# EasyEDA schematic SCH_IoTNode_2025-08-17.json
TITLE: Sheet_1; REV: 1.0; Date: 2025-08-13; Sheet: 1/1; Drawn By: digtaalfathir36; Company: BayMax
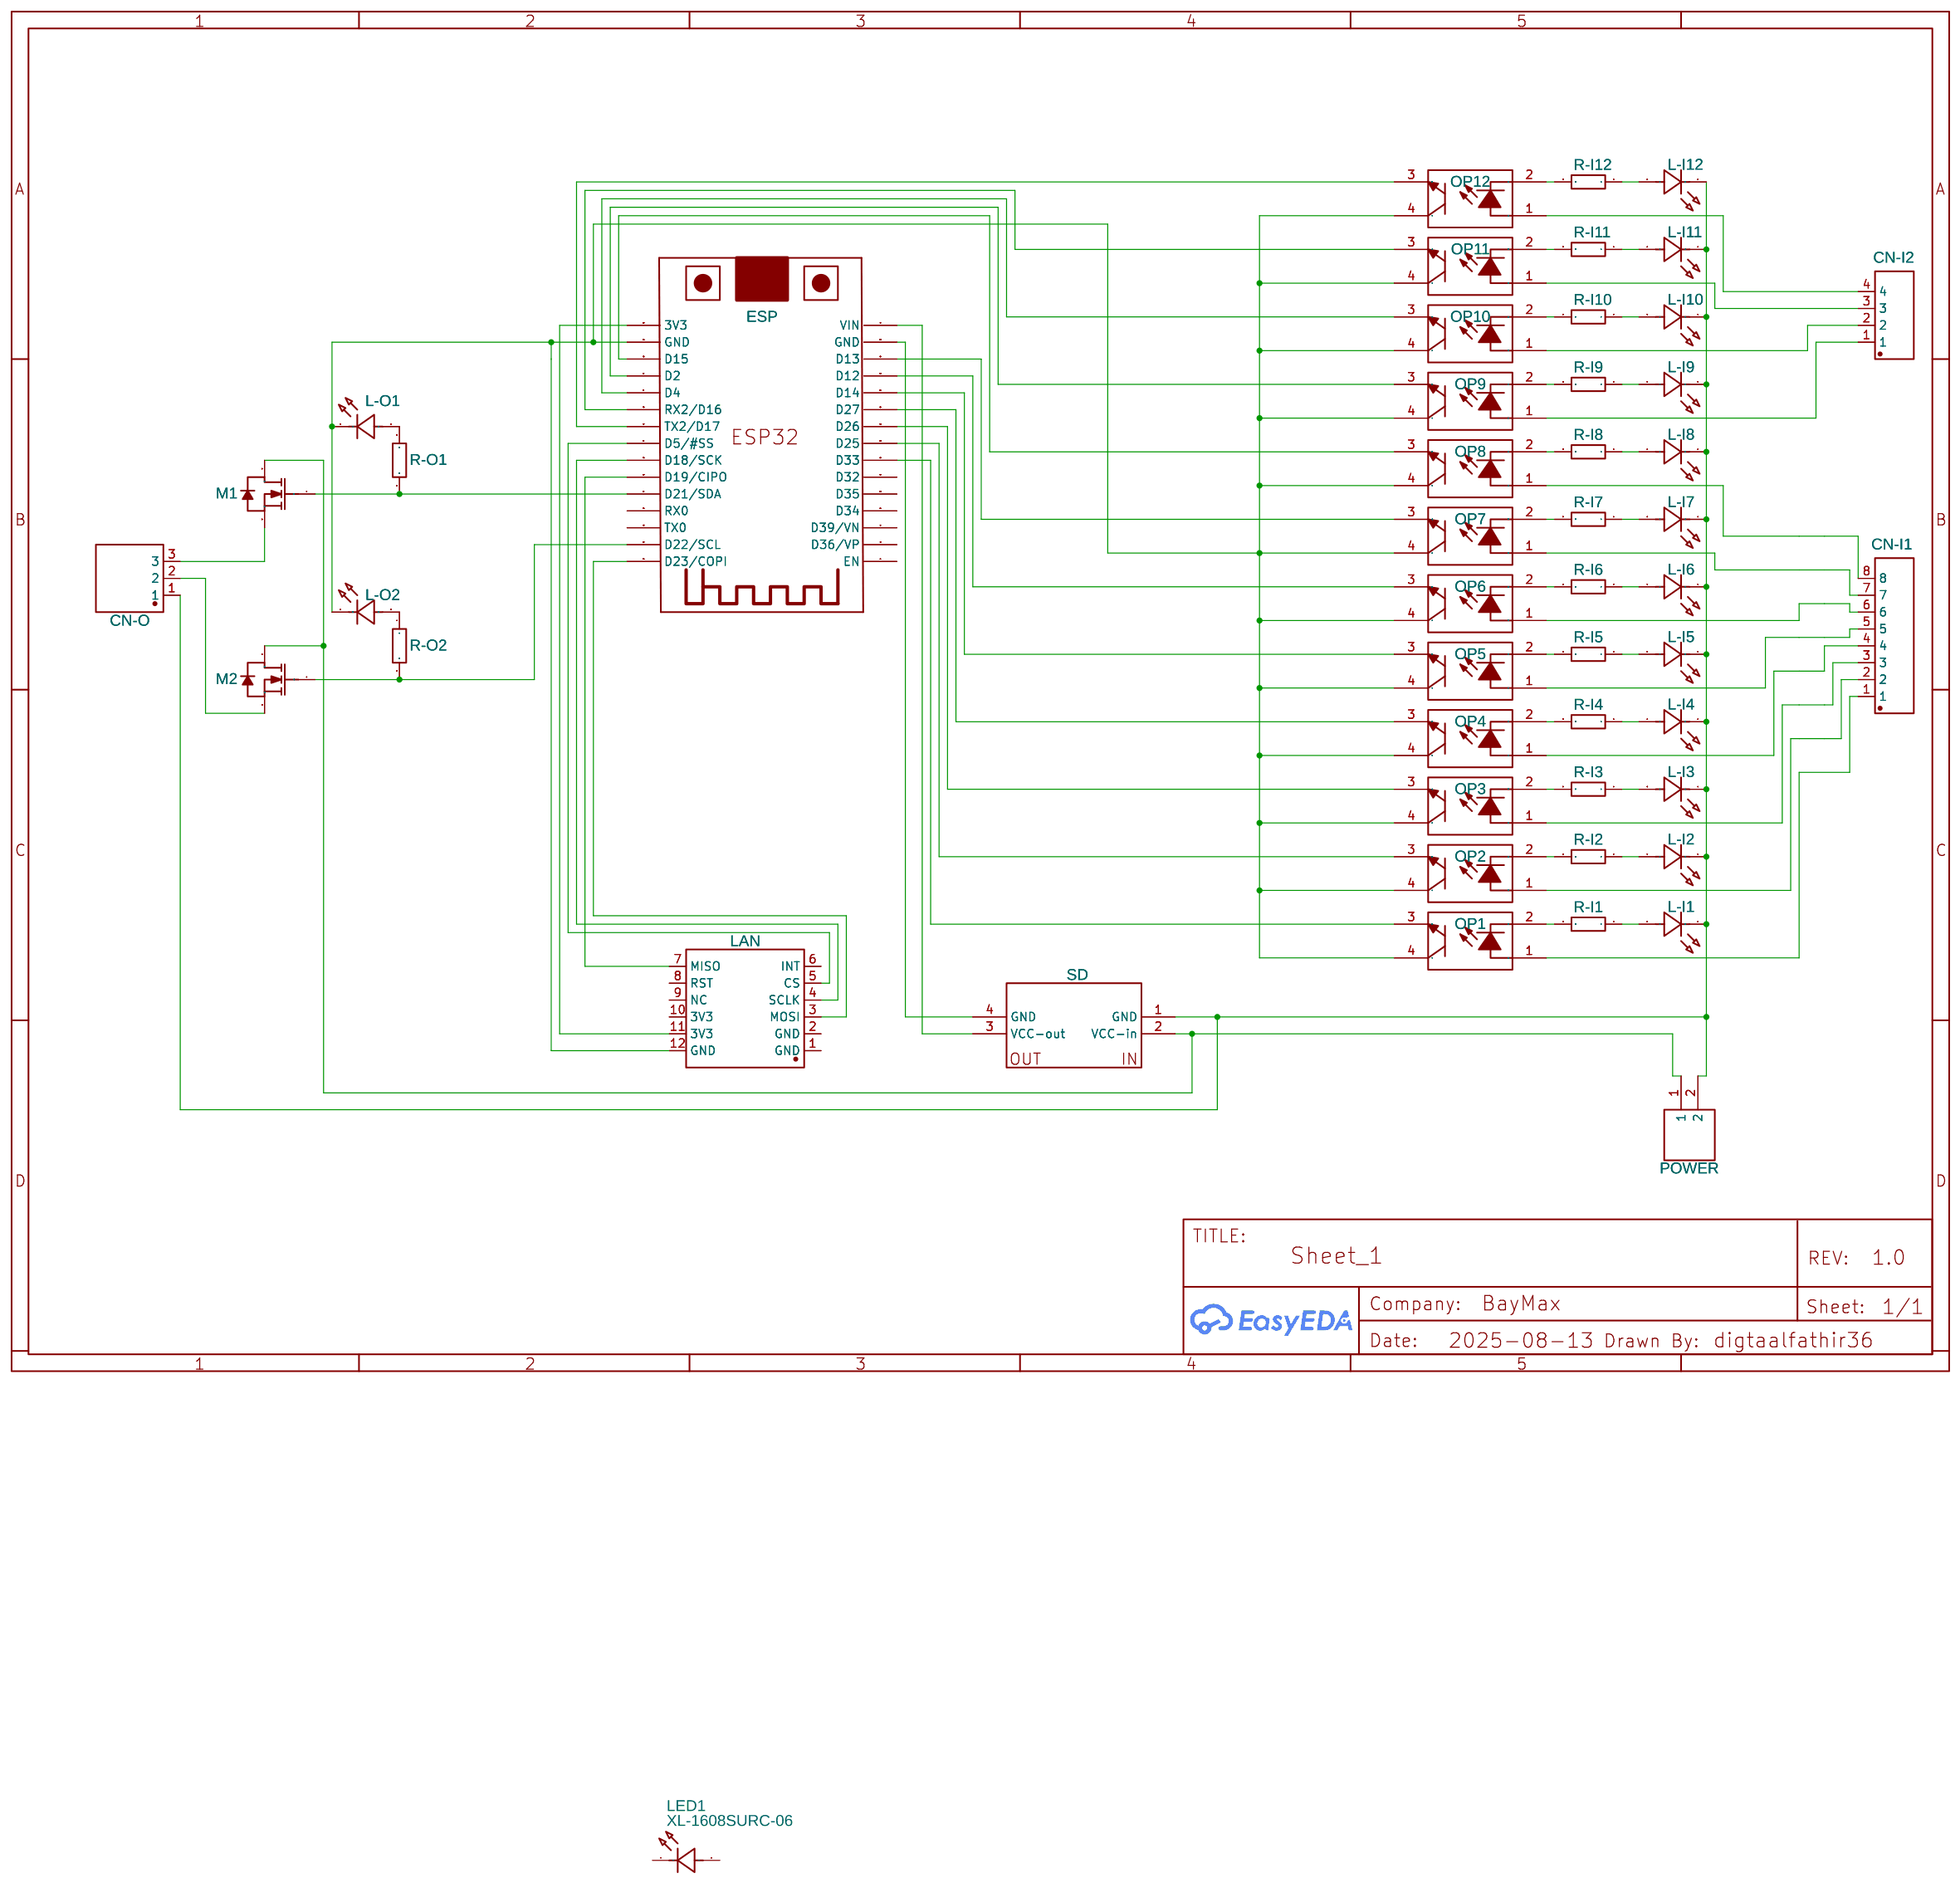
[diagram p0: schematic sheet]

## Parts
CN-I1  WJ2EDGRC-5.08-8P  [CONN-TH_8P-P5.08_WJ2EDGRC-5.08-8P]
CN-I2  WJ2EDGRC-5.08-4P  [CONN-TH_4P-P5.08_WJ2EDGRC-5.08-4P]
CN-O  WJ2EDGRC-5.08-3P_C8377  [CONN-TH_3P-P5.08_WJ2EDGRC-5.08-3P]
ESP  ESP32_30PIN_TESTccccccc  [ESP32-DEVKITV1_ESP32-DEVKITV1]
L-I1  XL-1608SURC-06  [LED0603-RD_RED]
L-I2  XL-1608SURC-06  [LED0603-RD_RED]
L-I3  XL-1608SURC-06  [LED0603-RD_RED]
L-I4  XL-1608SURC-06  [LED0603-RD_RED]
L-I5  XL-1608SURC-06  [LED0603-RD_RED]
L-I6  XL-1608SURC-06  [LED0603-RD_RED]
L-I7  XL-1608SURC-06  [LED0603-RD_RED]
L-I8  XL-1608SURC-06  [LED0603-RD_RED]
L-I9  XL-1608SURC-06  [LED0603-RD_RED]
L-I10  XL-1608SURC-06  [LED0603-RD_RED]
L-I11  XL-1608SURC-06  [LED0603-RD_RED]
L-I12  XL-1608SURC-06  [LED0603-RD_RED]
L-O1  XL-1608SURC-06  [LED0603-RD_RED]
L-O2  XL-1608SURC-06  [LED0603-RD_RED]
LAN  W5500_MODULE  [COMM-TH_L25.0-W23.0_W5500_MODULE]
LED1  XL-1608SURC-06  [LED0603-RD_RED]
M1  IRF520_C3280676  [TO-220-3_L10.0-W4.6-P2.54-L]
M2  IRF520_C3280676  [TO-220-3_L10.0-W4.6-P2.54-L]
OP1  PC817X3NSZW  [DIP-4_L6.4-W4.6-P2.54-LS7.6-BL]
OP2  PC817X3NSZW  [DIP-4_L6.4-W4.6-P2.54-LS7.6-BL]
OP3  PC817X3NSZW  [DIP-4_L6.4-W4.6-P2.54-LS7.6-BL]
OP4  PC817X3NSZW  [DIP-4_L6.4-W4.6-P2.54-LS7.6-BL]
OP5  PC817X3NSZW  [DIP-4_L6.4-W4.6-P2.54-LS7.6-BL]
OP6  PC817X3NSZW  [DIP-4_L6.4-W4.6-P2.54-LS7.6-BL]
OP7  PC817X3NSZW  [DIP-4_L6.4-W4.6-P2.54-LS7.6-BL]
OP8  PC817X3NSZW  [DIP-4_L6.4-W4.6-P2.54-LS7.6-BL]
OP9  PC817X3NSZW  [DIP-4_L6.4-W4.6-P2.54-LS7.6-BL]
OP10  PC817X3NSZW  [DIP-4_L6.4-W4.6-P2.54-LS7.6-BL]
OP11  PC817X3NSZW  [DIP-4_L6.4-W4.6-P2.54-LS7.6-BL]
OP12  PC817X3NSZW  [DIP-4_L6.4-W4.6-P2.54-LS7.6-BL]
POWER  WJ2EDGRC-5.08-2P  [CONN-TH_2P-P5.08_WJ2EDGRC-5.08-2P]
R-I1  10kΩ  [R0603]
R-I2  10kΩ  [R0603]
R-I3  10kΩ  [R0603]
R-I4  10kΩ  [R0603]
R-I5  10kΩ  [R0603]
R-I6  10kΩ  [R0603]
R-I7  10kΩ  [R0603]
R-I8  10kΩ  [R0603]
R-I9  10kΩ  [R0603]
R-I10  10kΩ  [R0603]
R-I11  10kΩ  [R0603]
R-I12  10kΩ  [R0603]
R-O1  10kΩ  [R0603]
R-O2  10kΩ  [R0603]
SD  MP1584 step down Module  [MP1584 STEP DOWN MODULE - PCB]

## Library data of the parts
CN-I1 = WJ2EDGRC-5.08-8P: Supplier: LCSC; Supplier Part: C27587; JLCPCB Part Class: Extended Part; Manufacturer: KANGNEX(康奈克斯电气)
CN-I2 = WJ2EDGRC-5.08-4P: Supplier: LCSC; Manufacturer: KANGNEX(康奈克斯电气); Supplier Part: C8446; JLCPCB Part Class: Extended Part
CN-O = WJ2EDGRC-5.08-3P_C8377: Contributor: LCSC; Supplier: LCSC; Supplier Part: C8377; Manufacturer: KANGNEX(康奈克斯电气); Manufacturer Part: WJ2EDGRC-5.08-3P; JLCPCB Part Class: Extended Part
ESP = ESP32-DEVKIT-V1-30PIN: Contributor: theecharat
L-I1-L-I12 L-O1 L-O2 LED1 = XL-1608SURC-06: Contributor: LCSC; Supplier: LCSC; Supplier Part: C965799; Manufacturer: XINGLIGHT(成兴光); JLCPCB Part Class: Extended Part
LAN = W5500_MODULE: Supplier: LCSC; Supplier Part: C9900160625; Manufacturer: null
M1 M2 = IRF520_C3280676: Contributor: lcsc; Supplier: LCSC; Supplier Part: C3280676; Manufacturer: HARRIS(哈利斯); Manufacturer Part: IRF520; JLCPCB Part Class: Extended Part
OP1-OP12 = PC817X3NSZW: Contributor: LCSC; Supplier: LCSC; Supplier Part: C2840441; Manufacturer: SHARP(夏普); JLCPCB Part Class: Extended Part
POWER = WJ2EDGRC-5.08-2P: Supplier: LCSC; Manufacturer: KANGNEX(康奈克斯电气); Supplier Part: C3697; JLCPCB Part Class: Extended Part
R-I1-R-I12 R-O1 R-O2 = RC0603FR-0710KL: Supplier: LCSC; Manufacturer: YAGEO(国巨); Supplier Part: C98220; JLCPCB Part Class: Extended Part
SD = MP1584 step down Module: Manufacturer Part: MP1584 Module; link: http://ali.pub/53j9ob; Contributor: victorjaredsalazargarcia

## Nets
Net-(CN-I1-1): CN-I1.1 OP1.1
Net-(CN-I1-2): CN-I1.2 OP2.1
Net-(CN-I1-3): CN-I1.3 OP3.1
Net-(CN-I1-4): CN-I1.4 OP4.1
Net-(CN-I1-5): CN-I1.5 OP5.1
Net-(CN-I1-6): CN-I1.6 OP6.1
Net-(CN-I1-7): CN-I1.7 OP7.1
Net-(CN-I1-8): CN-I1.8 OP8.1
Net-(CN-I2-1): CN-I2.1 OP9.1
Net-(CN-I2-2): CN-I2.2 OP10.1
Net-(CN-I2-3): CN-I2.3 OP11.1
Net-(CN-I2-4): CN-I2.4 OP12.1
Net-(CN-O-1): CN-O.1 L-I1.1(K) L-I2.1(K) L-I3.1(K) L-I4.1(K) L-I5.1(K) L-I6.1(K) L-I7.1(K) L-I8.1(K) L-I9.1(K) L-I10.1(K) L-I11.1(K) L-I12.1(K) POWER.2 SD.1(GND)
Net-(CN-O-2): CN-O.2 M2.3(S)
Net-(CN-O-3): CN-O.3 M1.3(S)
Net-(ESP-3V3): ESP.3V3 LAN.11(3V3)
Net-(ESP-D2): ESP.D2 OP9.3
Net-(ESP-D4): ESP.D4 OP10.3
Net-(ESP-D5): ESP.D5(D5/#SS) LAN.5(CS)
Net-(ESP-D12): ESP.D12 OP6.3
Net-(ESP-D13): ESP.D13 OP7.3
Net-(ESP-D14): ESP.D14 OP5.3
Net-(ESP-D15): ESP.D15 OP8.3
Net-(ESP-D18): ESP.D18(D18/SCK) LAN.4(SCLK)
Net-(ESP-D19): ESP.D19(D19/CIPO) LAN.7(MISO)
Net-(ESP-D21): ESP.D21(D21/SDA) M1.1(G) R-O1.2
Net-(ESP-D22): ESP.D22(D22/SCL) M2.1(G) R-O2.2
Net-(ESP-D23): ESP.D23(D23/COPI) LAN.3(MOSI)
Net-(ESP-D25): ESP.D25 OP2.3
Net-(ESP-D26): ESP.D26 OP3.3
Net-(ESP-D27): ESP.D27 OP4.3
Net-(ESP-D33): ESP.D33 OP1.3
Net-(ESP-GND2): ESP.GND2(GND) SD.4(GND)
Net-(ESP-GND): ESP.GND L-O1.1(K) L-O2.1(K) LAN.12(GND) OP1.4 OP2.4 OP3.4 OP4.4 OP5.4 OP6.4 OP7.4 OP8.4 OP9.4 OP10.4 OP11.4 OP12.4
Net-(ESP-RX2): ESP.RX2(RX2/D16) OP11.3
Net-(ESP-TX2): ESP.TX2(TX2/D17) OP12.3
Net-(ESP-VIN): ESP.VIN SD.3(VCC-out)
Net-(L-I1-2): L-I1.2(A) R-I1.1
Net-(L-I2-2): L-I2.2(A) R-I2.1
Net-(L-I3-2): L-I3.2(A) R-I3.1
Net-(L-I4-2): L-I4.2(A) R-I4.1
Net-(L-I5-2): L-I5.2(A) R-I5.1
Net-(L-I6-2): L-I6.2(A) R-I6.1
Net-(L-I7-2): L-I7.2(A) R-I7.1
Net-(L-I8-2): L-I8.2(A) R-I8.1
Net-(L-I9-2): L-I9.2(A) R-I9.1
Net-(L-I10-2): L-I10.2(A) R-I10.1
Net-(L-I11-2): L-I11.2(A) R-I11.1
Net-(L-I12-2): L-I12.2(A) R-I12.1
Net-(L-O1-2): L-O1.2(A) R-O1.1
Net-(L-O2-2): L-O2.2(A) R-O2.1
Net-(M1-2): M1.2(D) M2.2(D) POWER.1 SD.2(VCC-in)
Net-(OP1-2): OP1.2 R-I1.2
Net-(OP2-2): OP2.2 R-I2.2
Net-(OP3-2): OP3.2 R-I3.2
Net-(OP4-2): OP4.2 R-I4.2
Net-(OP5-2): OP5.2 R-I5.2
Net-(OP6-2): OP6.2 R-I6.2
Net-(OP7-2): OP7.2 R-I7.2
Net-(OP8-2): OP8.2 R-I8.2
Net-(OP9-2): OP9.2 R-I9.2
Net-(OP10-2): OP10.2 R-I10.2
Net-(OP11-2): OP11.2 R-I11.2
Net-(OP12-2): OP12.2 R-I12.2

Not connected (* = marked no-connect by the designer): ESP D32 D34 D35 EN RX0 TX0 VN(D39/VN) VP(D36/VP); LAN 1(GND) 2(GND) 6(INT) 8(RST) 9(NC) 10(3V3); LED1 1(K) 2(A)
